# EAGLE design zmpt101b - 3phase din v0.3 (EAGLE 9.6.2)
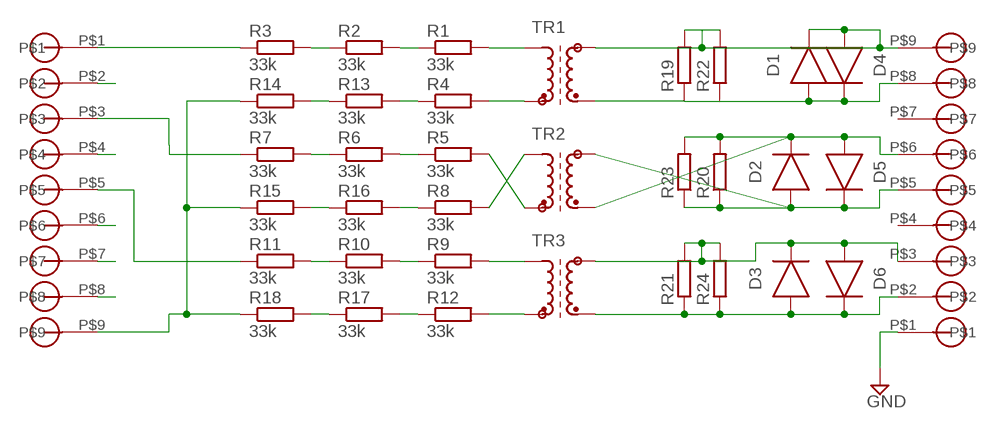
[diagram p0: schematic, sheet 1]

## Parts
D1  DIODE_DO-219-AB(SOD123F)  [SODFL3718X115]
D2  DIODE_DO-219-AB(SOD123F)  [SODFL3718X115]
D3  DIODE_DO-219-AB(SOD123F)  [SODFL3718X115]
D4  DIODE_DO-219-AB(SOD123F)  [SODFL3718X115]
D5  DIODE_DO-219-AB(SOD123F)  [SODFL3718X115]
D6  DIODE_DO-219-AB(SOD123F)  [SODFL3718X115]
R1  33k  R-EU_R1206  [R1206]
R2  33k  R-EU_R1206  [R1206]
R3  33k  R-EU_R1206  [R1206]
R4  33k  R-EU_R1206  [R1206]
R5  33k  R-EU_R1206  [R1206]
R6  33k  R-EU_R1206  [R1206]
R7  33k  R-EU_R1206  [R1206]
R8  33k  R-EU_R1206  [R1206]
R9  33k  R-EU_R1206  [R1206]
R10  33k  R-EU_R1206  [R1206]
R11  33k  R-EU_R1206  [R1206]
R12  33k  R-EU_R1206  [R1206]
R13  33k  R-EU_R1206  [R1206]
R14  33k  R-EU_R1206  [R1206]
R15  33k  R-EU_R1206  [R1206]
R16  33k  R-EU_R1206  [R1206]
R17  33k  R-EU_R1206  [R1206]
R18  33k  R-EU_R1206  [R1206]
R19  110R  R-EU_R0603  [R0603]
R20  110R  R-EU_R0603  [R0603]
R21  110R  R-EU_R0603  [R0603]
R22  R-EU_0207/12  [0207/12]
R23  R-EU_0207/12  [0207/12]
R24  R-EU_0207/12  [0207/12]
TR1  ZMPT101B  [ZMPT101B]
TR2  ZMPT101B  [ZMPT101B]
TR3  ZMPT101B  [ZMPT101B]
U$1  5MMBLOCK_X9  [9/5.08]
U$2  5MMBLOCK_X9  [9/5.08]

## Nets
GND: U$2.P$1
N$1 [hv]: R3.1 U$1.P$1
N$2 [hv]: R2.1 R3.2
N$3 [hv]: R1.1 R2.2
N$4 [hv]: R1.2 TR1.P$4(A1)
N$5 [hv]: R4.2 TR1.P$3(E1)
N$6 [ne]: R14.1 R15.1 R18.1 U$1.P$9
N$7 [hv]: R7.1 U$1.P$3
N$8 [hv]: R6.1 R7.2
N$9 [hv]: R5.1 R6.2
N$10 [hv]: R8.2 TR2.P$4(A1)
N$11 [hv]: R5.2 TR2.P$3(E1)
N$13 [hv]: R11.1 U$1.P$5
N$14 [hv]: R10.1 R11.2
N$15 [hv]: R9.1 R10.2
N$16 [hv]: R9.2 TR3.P$4(A1)
N$17 [hv]: R12.2 TR3.P$3(E1)
N$18: D2.2(A) D5.1(C) R20.1 R23.1 TR2.P$1(A2) U$2.P$5
N$19: D2.1(C) D5.2(A) R20.2 R23.2 TR2.P$2(E2) U$2.P$6
N$20: D1.2(A) D4.1(C) R19.1 R22.1 TR1.P$2(E2) U$2.P$8
N$21: D1.1(C) D4.2(A) R19.2 R22.2 TR1.P$1(A2) U$2.P$9
N$22: U$1.P$2
N$23: U$1.P$4
N$24: U$1.P$7
N$25: U$1.P$6
N$26: U$1.P$8
N$27: D3.2(A) D6.1(C) R21.1 R24.1 TR3.P$2(E2) U$2.P$2
N$28 [hv]: R4.1 R13.2
N$29 [hv]: R13.1 R14.2
N$30 [hv]: R8.1 R16.2
N$31 [hv]: R15.2 R16.1
N$32 [hv]: R12.1 R17.2
N$33 [hv]: R17.1 R18.2
N$34: D3.1(C) D6.2(A) R21.2 R24.2 TR3.P$1(A2) U$2.P$3

## Power pins joined to a net without a drawn wire
P$4: U$2.P$4
P$7: U$2.P$7

## Library data of the parts
D1-D6 = Diode:DIODE: Diode Rectifier - Generic; CATEGORY: Diode; SUB-CATEGORY: Rectifier
R1-R24 = rcl:R-EU_: RESISTOR, European symbol; SPICEPREFIX: R
TR1-TR3 = ZMPT101B:ZMPT101B: TRANSFORMER; OC_FARNELL: unknown; OC_NEWARK: unknown
U$1 U$2 = 5mm terminal block:5MMBLOCK_X9

## Net classes
1 hv: drill 0.5 mm, clearance 3 mm
2 ne: clearance 1.25 mm

## Board
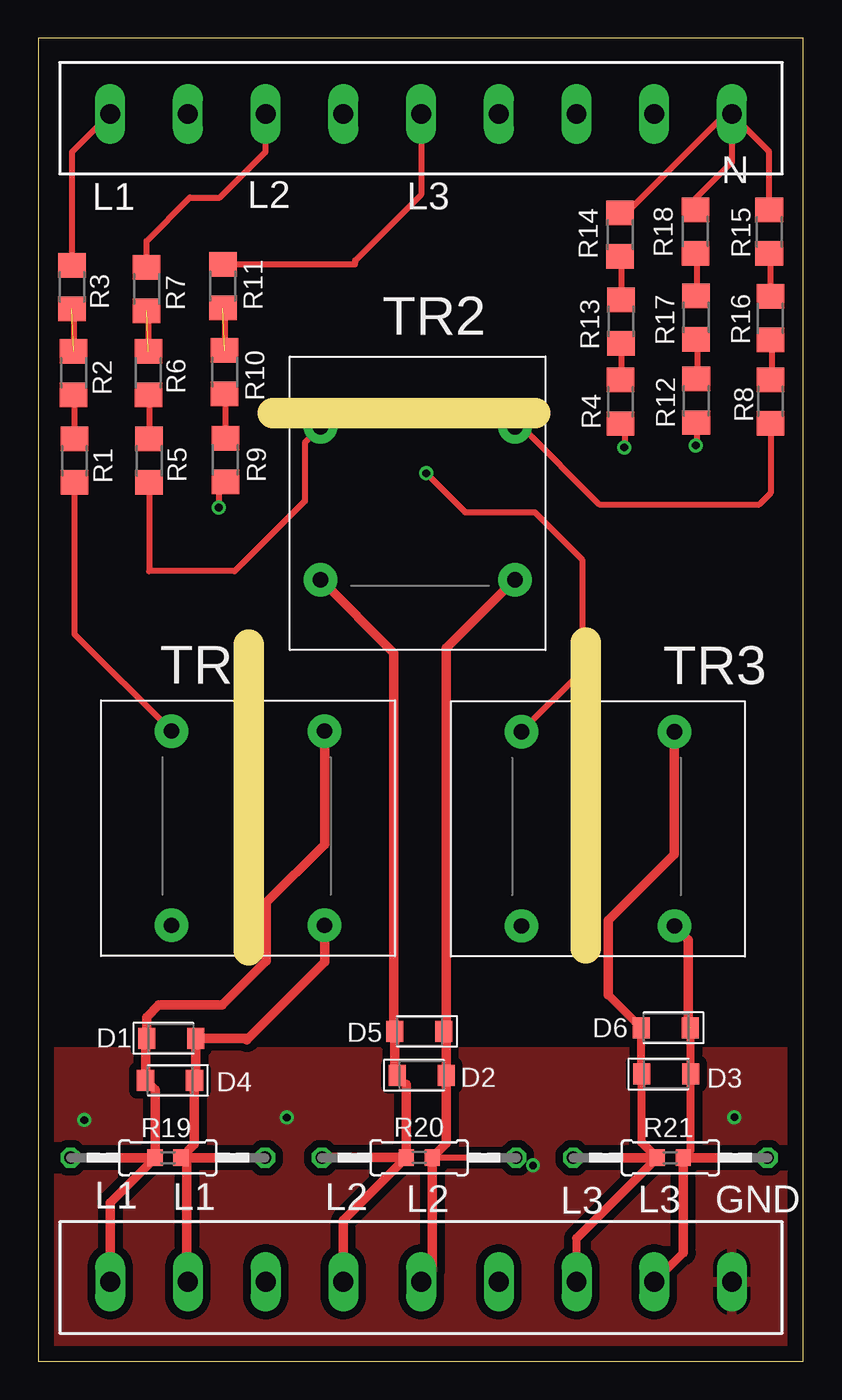
[diagram p1: board, top side]
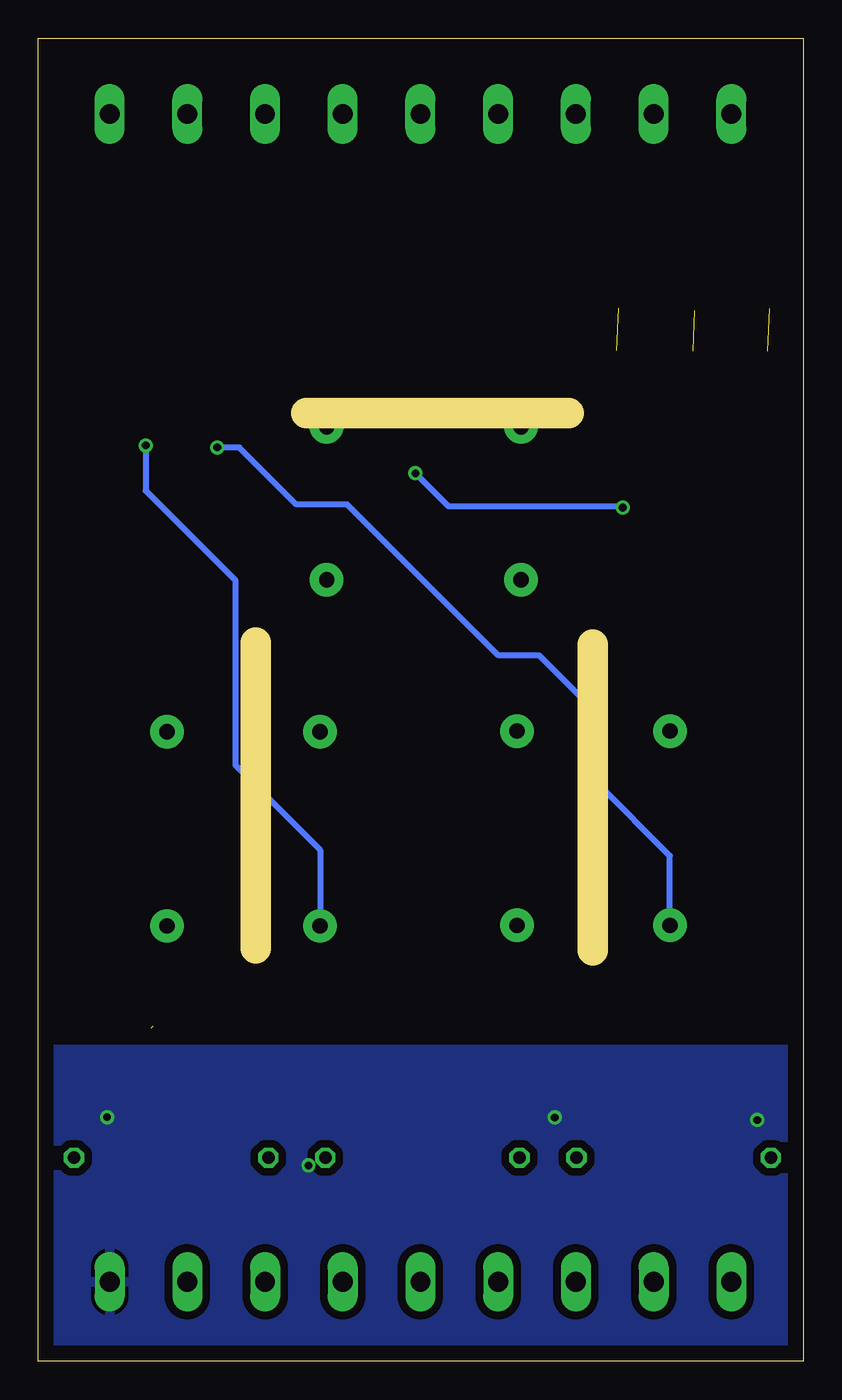
[diagram p2: board, bottom side, seen from below]

Size 50 x 86.5 mm. Coordinates in mm from the lower left corner, seen from the top.
Outline: 0,0 50,0 50,86.5 0,86.5 0,0
Copper layers (1*16): Top 0.035mm / dielectric 0.15mm / Bottom 0.035mm
Design rules "default": minimum track width 6mil, minimum drill 0.35mm, track to track 6mil, track to pad 6mil, pad to pad 6mil, via to via 6mil, smd to smd 6mil, copper to edge 40mil, drill to drill 6mil, minimum pad ring 10mil, minimum via ring 8mil, stop-mask expansion 4mil, vias tented up to drill 0mil, thermal gap 10mil
Milling: 3 lines

### Footprints (pad centres in the part's own frame; a part is rotated, then mirrored left to right if it is on the bottom)
SODFL3718X115 = smd 1.115 x 1.361: 1 -1.6,0; 2 1.6,0
R1206 = smd 1.6 x 1.803: 1 -1.422,0; 2 1.422,0
R0603 = smd 1 x 1.1: 1 -0.85,0; 2 0.85,0
0207/12 = drill 0.813 octagon: 1 -6.35,0; 2 6.35,0
ZMPT101B = drill 1 pad 2.184: P$1 14.6,14.7; P$2 14.6,2; P$3 4.6,2; P$4 4.6,14.7
9/5.08 = drill 1.3 long: P$1 -2.54,0; P$2 2.54,0; P$3 7.62,0; P$4 12.7,0; P$5 17.78,0; P$6 22.86,0; P$7 27.94,0; P$8 33.02,0; P$9 38.1,0

### Placement (x,y rotation side)
D1  8.69,21.12 0 top
D2  25.07,18.7 0 top
D3  41.04,18.78 0 top
D4  8.61,18.37 180 top
D5  24.91,21.57 180 top
D6  41.02,21.8 180 top
R1  2.37,58.87 270 top
R2  2.31,64.61 270 top
R3  2.2,70.24 270 top
R4  38.05,62.73 270 top
R5  7.25,58.87 270 top
R6  7.2,64.61 270 top
R7  7.09,70.11 270 top
R8  47.86,62.75 270 top
R9  12.23,58.93 270 top
R10  12.18,64.66 270 top
R11  12.07,70.29 270 top
R12  43.01,62.79 270 top
R13  38.09,67.98 270 top
R14  38.03,73.65 270 top
R15  47.77,73.84 270 top
R16  47.85,68.19 270 top
R17  43,68.23 270 top
R18  42.95,73.85 270 top
R19  8.49,13.31 180 top
R20  24.9,13.32 180 top
R21  41.31,13.31 180 top
R22  8.47,13.31 180 top
R23  24.89,13.31 180 top
R24  41.31,13.31 180 top
TR1  4.11,26.5 0 top
TR2  16.45,65.7 270 top
TR3  26.98,26.46 0 top
U$1  7.24,81.55 0 top
U$2  42.8,5.19 180 top

### Tracks (layer width: path | path; a pad name or v marks a point on that pad's centre or on a via)
GND  (via drill 0.5)
  other vias: 45.5,15.96 16.24,15.94 32.34,12.8 3.01,15.77
  pour Top (isolate 0.508): -5.85,20.23 56.97,20.23 56.97,-6.99 -6.23,-6.99
  pour Bottom (isolate 0.508): -9.3,20.4 55.15,20.4 55.15,-5.32 -10.33,-5.32
N$1
  Top 0.406: U$1.P$1 2.2,79.05 R3.1
N$2  (1 unrouted)
  Top 0.406: R3.2 2.31,68.7 R2.1
N$3
  Top 0.406: R2.2 2.37,63.13 R1.1
N$4
  Top 0.406: R1.2 2.37,47.55 TR1.P$4
N$5  (via drill 0.5)
  Top 0.406: R4.2 38.32,61.04 38.32,59.77 v38.3,59.74
  Bottom 0.406: TR1.P$3 8.71,33.04 13.41,37.74 13.41,42.29 17.27,46.15 19.93,46.15 29.81,56.02 33.13,56.02 36.85,59.74 v38.3,59.74
N$6
  Top 0.406: 45.26,81.47 U$1.P$9 | 38.24,74.7 R14.1 38.44,75.07 44.92,81.55 U$1.P$9 | 43,74.7 R18.1 42.95,76 45.34,78.39 45.34,81.53 | 47.74,74.66 R15.1 47.77,79.1 45.34,81.53 | 45.34,81.53 U$1.P$9
N$7
  Top 0.406: R7.1 7.09,73.25 9.91,76.08 11.87,76.08 14.86,79.07 U$1.P$3
N$8  (1 unrouted)
  Top 0.406: R7.2 7.2,68.58 R6.1
N$9
  Top 0.406: R6.2 7.25,63.13 R5.1
N$10
  Top 0.406: TR2.P$4 31.59,61.1 36.67,56.02 47.11,56.02 47.86,56.77 R8.2
N$11
  Top 0.406: R5.2 7.25,51.66 12.84,51.66 17.42,56.24 17.42,60.06 TR2.P$3
N$13
  Top 0.406: U$1.P$5 25.02,76.27 20.71,71.96 20.69,71.71 R11.1
N$14  (1 unrouted)
  Top 0.406: R11.2 12.18,68.75 R10.1
N$15
  Top 0.406: R10.2 12.23,63.18 R9.1
N$16  (via drill 0.5)
  Top 0.406: TR3.P$4 35.54,45.13 35.54,52.43 32.46,55.51 27.91,55.51 v25.35,58.06 | R9.2 11.8,57.07 v11.8,55.82
  Bottom 0.406: v25.35,58.06 23.19,55.9 11.88,55.9 v11.8,55.82
N$17  (via drill 0.5)
  Top 0.406: v42.98,59.88 43.04,59.81 43.04,61.33 R12.2
  Bottom 0.406: v42.98,59.88 42.98,56.92 37.12,51.07 37.12,38.97 31.58,33.43 TR3.P$3
N$18
  Top 0.406: 26.68,21.89 26.51,21.72 D5.1 | 25.75,5.92 U$2.P$5 | R23.1 25.77,13.31 R20.1
  Top 0.61: TR2.P$1 26.68,46.63 26.68,21.89 | 25.75,5.92 R20.1 26.67,14.23 D2.2 26.67,21.41 D5.1
N$19
  Top 0.406: 23.31,18.86 D2.1 24.05,18.11 | 18.55,13.32 R23.2
  Top 0.61: TR2.P$2 23.23,46.32 23.23,21.91 23.31,21.83 D5.2 23.31,18.86 | U$2.P$6 19.94,9.21 R20.2 | 24.05,18.11 R20.2 | R20.2 18.55,13.32
N$20
  Top 0.406: 13.63,21.12 13.63,21.02 | 10.29,18.44 D4.1 | 9.7,12.95 R19.1
  Top 0.61: TR1.P$2 18.71,26.1 13.63,21.02 | 13.63,21.12 D1.2 10.29,18.44 | D4.1 10.21,14.19 R19.1 | 9.7,12.95 9.7,5.27 U$2.P$8 | R22.1 R19.1
N$21
  Top 0.406: R22.2
  Top 0.61: TR1.P$1 18.71,33.78 14.91,29.98 14.91,26.18 12.03,23.3 7.88,23.3 7.09,22.5 D1.1 7.01,21.04 D4.2 7.64,17.74 R19.2 | R19.2 4.7,10.37 U$2.P$9 | R19.2 R22.2
N$27  (1 unrouted)
  Top 0.406: R21.1
  Top 0.508: R21.1 42.64,13.8 D3.2 42.64,21.78 D6.1 | U$2.P$2 42.16,7.09
  Top 0.61: 42.16,7.09 R21.1 | TR3.P$2 42.5,27.54 42.5,21.92 | R24.1 R21.1
N$28
  Top 0.406: R13.2 | R13.2 38.09,63.61 R4.1
N$29
  Top 0.406: R14.2 38.09,72.17 R13.1
N$30
  Top 0.406: R8.1 47.94,64.25 47.94,67.25 47.86,67.33 R16.2
N$31
  Top 0.406: R16.1 47.85,72.34 R15.2
N$32
  Top 0.406: R17.2 43.08,66.73 43.08,63.73 43,63.65 R12.1
N$33
  Top 0.406: R18.2 43.03,72.35 43.03,69.11 R17.1
N$34
  Top 0.406: R24.2
  Top 0.508: 39.44,14.33 D3.1 39.42,18.8 D6.2 37.27,23.95 | U$2.P$3 35.18,8.04
  Top 0.61: TR3.P$1 41.58,33.15 37.27,28.84 37.27,23.95 | R21.2 39.44,14.33 | 35.18,8.04 R21.2 | R21.2 R24.2

### Text on the board
tNames: N | L1 | L2 | L3 | L1 | L1 | L2 | L2 | L3 | L3 | GND